# Altium schematic sheet 4-USB-A.SchDoc
size A4
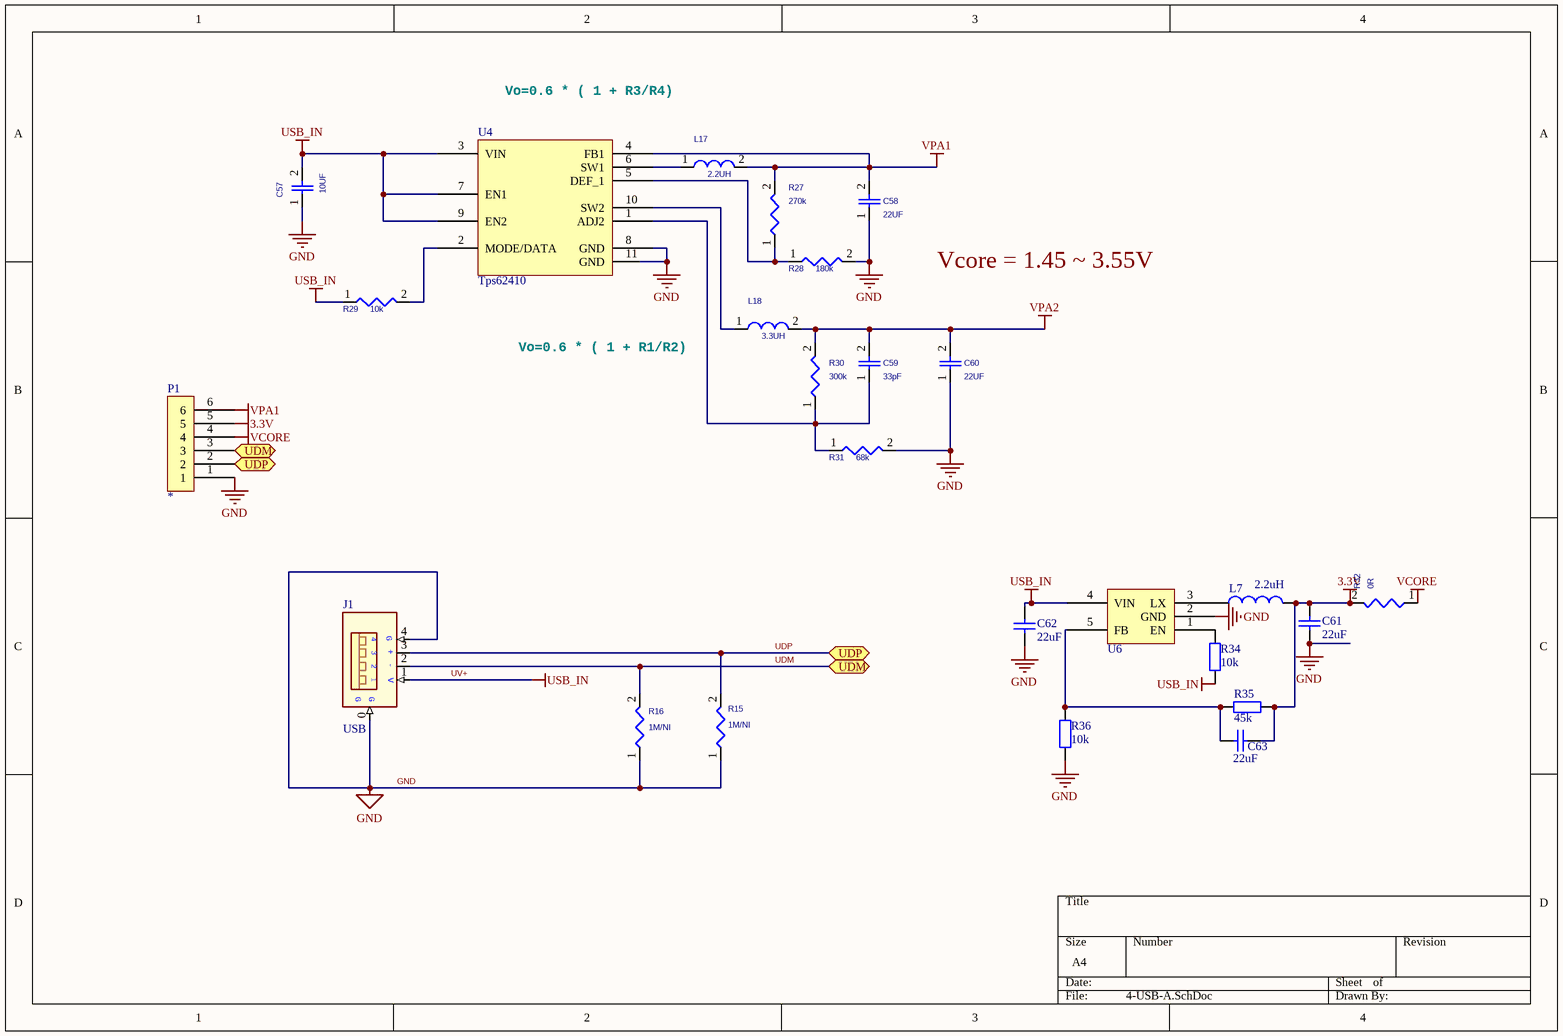
[diagram p0: 4-USB-A.SchDoc]

## Parts
C57  10UF  [0805]
C58  22UF  [0805]
C59  33pF  [0402]
C60  22UF  [0805]
C61  value 22uF  [0805]  (hidden comment: Cap)
C62  value 22uF  [0805]  (hidden comment: Cap)
C63  value 22uF  [0402]  (hidden comment: Cap)
J1  USB  [USB-A-MALE]
L7  2.2uH  [0805]
L17  2.2UH  [L3015]
L18  3.3UH  [L3015]
P1  *  [6PSocket]
R15  1M/NI  [0402]
R16  1M/NI  [0402]
R27  270k  [0402]
R28  180k  [0402]
R29  10k  [0402]
R30  300k  [0402]
R31  68k  [0402]
R32  0R  [0402]
R34  10k  [0402]
R35  45k  [0402]
R36  10k  [0402]
U4  Tps62410  [DFN-10P-3X3]
U6  RT8059  [SOT23-5]  (value not drawn)

## Ports
UDM (bidir), UDP (bidir)

## Nets
3.3V: C61.2 C63.1 L7.2 P1.5 R32.2 R35.2
GND: C57.1 C58.1 C60.1 C61.1 C62.1 J1.0(G) J1.4(G) P1.1 R15.1 R16.1 R28.2 R31.2 R36.1 U4.8(GND) U4.11(GND) U6.2(GND)
UV+: C57.2 C62.2 J1.1(V+) R29.1 R34.2 U4.3(VIN) U4.7(EN1) U4.9(EN2) U6.4(VIN)  [also labelled USB_IN]
VCORE: P1.4 R32.1
VPA1: C58.2 L17.2 P1.6 R27.2 U4.4(FB1)
VPA2: C59.2 C60.2 L18.2 R30.2
UDM: J1.2(D-) P1.3 R16.2 ; port UDM
UDP: J1.3(D+) P1.2 R15.2 ; port UDP
NetC59_1: C59.1 R30.1 R31.1 U4.1(ADJ2)
NetC63_2: C63.2 R35.1 R36.2 U6.5(FB)
NetL7_1: L7.1 U6.3(LX)
NetL17_1: L17.1 U4.6(SW1)
NetL18_1: L18.1 U4.10(SW2)
NetR27_1: R27.1 R28.1 U4.5(DEF_1)
NetR29_2: R29.2 U4.2(MODE/DATA)
NetR34_1: R34.1 U6.1(EN)

## Notes on the sheet
- Vo=0.6 * ( 1 + R3/R4)
- Vcore = 1.45 ~ 3.55V
- Vo=0.6 * ( 1 + R1/R2)
- (in symbol USB) +; -; V

## Library data of the parts
C57 C58 C60 = CAP/0402: 1st Part Field: 0402
C59 = CAP/0402: 1st Part Field: 0402
C61-C63 = Cap: Capacitor; Published: 8-Jun-2000; LatestRevisionDate: 17-Jul-2002; LatestRevisionNote: Re-released for DXP Platform.; PackageReference: RAD-0.3; Publisher: Altium Limited; PackageDescription: Radial Cap, Thru-Hole; 2 Leads; 0.3 in Pin Spacing
L7 = Inductor: Code_IEC: 1005; Published: 8-Jun-2000; LatestRevisionDate: 29-May-2009; LatestRevisionNote: IPC-7351 Footprint Added.; PackageReference: 0402-A; Publisher: Altium Limited; PackageDescription: Chip Inductor; Code_JEITA: 0402
L17 L18 = L/2.5*2.0
P1 = 6PSocket
R15 R16 = RES/0402_2
R27-R32 = RES/0402_3
R34-R36 = Res2: Resistor; Published: 8-Jun-2000; LatestRevisionDate: 17-Jul-2002; LatestRevisionNote: Re-released for DXP Platform.; PackageReference: AXIAL-0.4; Publisher: Altium Limited; PackageDescription: Axial Device, Thru-Hole; 2 Leads; 0.4 in Pin Spacing